# EAGLE schematic MEGA_shield_PORTS (EAGLE 7.5.0)
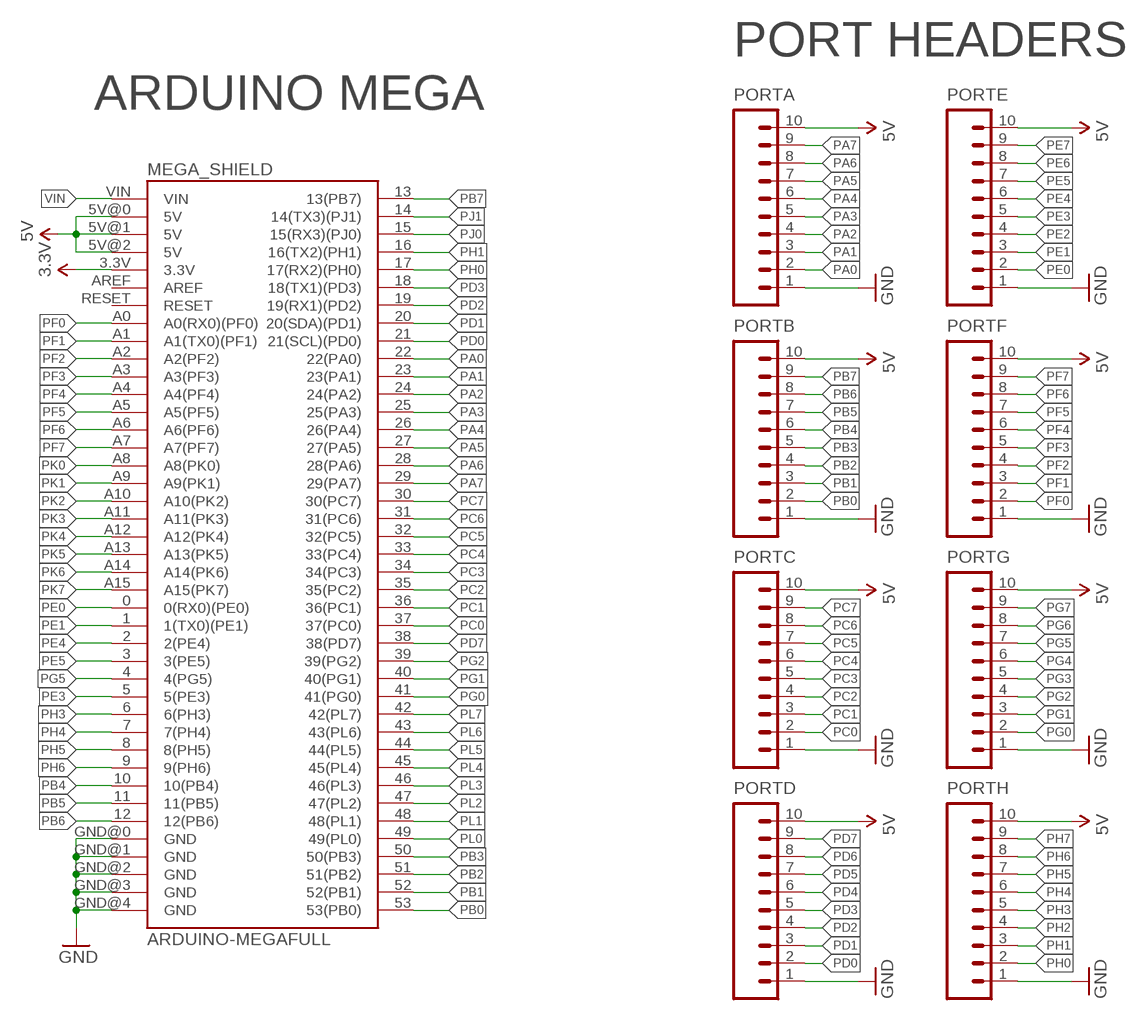
[diagram p0: schematic, sheet 1]

## Parts
MEGA_SHIELD  ARDUINO-MEGAFULL  [ARDUINO_MEGA]
PORTA  M10NO_SILK_PTH_FEMALE  [1X10_NO_SILK]
PORTB  M10NO_SILK_PTH_FEMALE  [1X10_NO_SILK]
PORTC  M10NO_SILK_PTH_FEMALE  [1X10_NO_SILK]
PORTD  M10NO_SILK_PTH_FEMALE  [1X10_NO_SILK]
PORTE  M10NO_SILK_PTH_FEMALE  [1X10_NO_SILK]
PORTF  M10NO_SILK_PTH_FEMALE  [1X10_NO_SILK]
PORTG  M10NO_SILK_PTH_FEMALE  [1X10_NO_SILK]
PORTH  M10NO_SILK_PTH_FEMALE  [1X10_NO_SILK]

## Nets
3.3V: MEGA_SHIELD.3.3V
5V: MEGA_SHIELD.5V@0(5V) MEGA_SHIELD.5V@1(5V) MEGA_SHIELD.5V@2(5V) PORTA.10 PORTB.10 PORTC.10 PORTD.10 PORTE.10 PORTF.10 PORTG.10 PORTH.10
GND: MEGA_SHIELD.GND@0(GND) MEGA_SHIELD.GND@1(GND) MEGA_SHIELD.GND@2(GND) MEGA_SHIELD.GND@3(GND) MEGA_SHIELD.GND@4(GND) PORTA.1 PORTB.1 PORTC.1 PORTD.1 PORTE.1 PORTF.1 PORTG.1 PORTH.1
PA0: MEGA_SHIELD.22(22(PA0)) PORTA.2
PA1: MEGA_SHIELD.23(23(PA1)) PORTA.3
PA2: MEGA_SHIELD.24(24(PA2)) PORTA.4
PA3: MEGA_SHIELD.25(25(PA3)) PORTA.5
PA4: MEGA_SHIELD.26(26(PA4)) PORTA.6
PA5: MEGA_SHIELD.27(27(PA5)) PORTA.7
PA6: MEGA_SHIELD.28(28(PA6)) PORTA.8
PA7: MEGA_SHIELD.29(29(PA7)) PORTA.9
PB0: MEGA_SHIELD.53(53(PB0)) PORTB.2
PB1: MEGA_SHIELD.52(52(PB1)) PORTB.3
PB2: MEGA_SHIELD.51(51(PB2)) PORTB.4
PB3: MEGA_SHIELD.50(50(PB3)) PORTB.5
PB4: MEGA_SHIELD.10(10(PB4)) PORTB.6
PB5: MEGA_SHIELD.11(11(PB5)) PORTB.7
PB6: MEGA_SHIELD.12(12(PB6)) PORTB.8
PB7: MEGA_SHIELD.13(13(PB7)) PORTB.9
PC0: MEGA_SHIELD.37(37(PC0)) PORTC.2
PC1: MEGA_SHIELD.36(36(PC1)) PORTC.3
PC2: MEGA_SHIELD.35(35(PC2)) PORTC.4
PC3: MEGA_SHIELD.34(34(PC3)) PORTC.5
PC4: MEGA_SHIELD.33(33(PC4)) PORTC.6
PC5: MEGA_SHIELD.32(32(PC5)) PORTC.7
PC6: MEGA_SHIELD.31(31(PC6)) PORTC.8
PC7: MEGA_SHIELD.30(30(PC7)) PORTC.9
PD0: MEGA_SHIELD.21(21(SCL)(PD0)) PORTD.2
PD1: MEGA_SHIELD.20(20(SDA)(PD1)) PORTD.3
PD2: MEGA_SHIELD.19(19(RX1)(PD2)) PORTD.4
PD3: MEGA_SHIELD.18(18(TX1)(PD3)) PORTD.5
PD4: PORTD.6
PD5: PORTD.7
PD6: PORTD.8
PD7: MEGA_SHIELD.38(38(PD7)) PORTD.9
PE0: MEGA_SHIELD.0(0(RX0)(PE0)) PORTE.2
PE1: MEGA_SHIELD.1(1(TX0)(PE1)) PORTE.3
PE2: PORTE.4
PE3: MEGA_SHIELD.5(5(PE3)) PORTE.5
PE4: MEGA_SHIELD.2(2(PE4)) PORTE.6
PE5: MEGA_SHIELD.3(3(PE5)) PORTE.7
PE6: PORTE.8
PE7: PORTE.9
PF0: MEGA_SHIELD.A0(A0(RX0)(PF0)) PORTF.2
PF1: MEGA_SHIELD.A1(A1(TX0)(PF1)) PORTF.3
PF2: MEGA_SHIELD.A2(A2(PF2)) PORTF.4
PF3: MEGA_SHIELD.A3(A3(PF3)) PORTF.5
PF4: MEGA_SHIELD.A4(A4(PF4)) PORTF.6
PF5: MEGA_SHIELD.A5(A5(PF5)) PORTF.7
PF6: MEGA_SHIELD.A6(A6(PF6)) PORTF.8
PF7: MEGA_SHIELD.A7(A7(PF7)) PORTF.9
PG0: MEGA_SHIELD.41(41(PG0)) PORTG.2
PG1: MEGA_SHIELD.40(40(PG1)) PORTG.3
PG2: MEGA_SHIELD.39(39(PG2)) PORTG.4
PG3: PORTG.5
PG4: PORTG.6
PG5: MEGA_SHIELD.4(4(PG5)) PORTG.7
PG6: PORTG.8
PG7: PORTG.9
PH0: MEGA_SHIELD.17(17(RX2)(PH0)) PORTH.2
PH1: MEGA_SHIELD.16(16(TX2)(PH1)) PORTH.3
PH2: PORTH.4
PH3: MEGA_SHIELD.6(6(PH3)) PORTH.5
PH4: MEGA_SHIELD.7(7(PH4)) PORTH.6
PH5: MEGA_SHIELD.8(8(PH5)) PORTH.7
PH6: MEGA_SHIELD.9(9(PH6)) PORTH.8
PH7: PORTH.9
PJ0: MEGA_SHIELD.15(15(RX3)(PJ0))
PJ1: MEGA_SHIELD.14(14(TX3)(PJ1))
PK0: MEGA_SHIELD.A8(A8(PK0))
PK1: MEGA_SHIELD.A9(A9(PK1))
PK2: MEGA_SHIELD.A10(A10(PK2))
PK3: MEGA_SHIELD.A11(A11(PK3))
PK4: MEGA_SHIELD.A12(A12(PK4))
PK5: MEGA_SHIELD.A13(A13(PK5))
PK6: MEGA_SHIELD.A14(A14(PK6))
PK7: MEGA_SHIELD.A15(A15(PK7))
PL0: MEGA_SHIELD.49(49(PL0))
PL1: MEGA_SHIELD.48(48(PL1))
PL2: MEGA_SHIELD.47(47(PL2))
PL3: MEGA_SHIELD.46(46(PL3))
PL4: MEGA_SHIELD.45(45(PL4))
PL5: MEGA_SHIELD.44(44(PL5))
PL6: MEGA_SHIELD.43(43(PL6))
PL7: MEGA_SHIELD.42(42(PL7))
VIN: MEGA_SHIELD.VIN
Unconnected: MEGA_SHIELD.AREF MEGA_SHIELD.RESET

## Notes on the sheet
- PORT HEADERS
- ARDUINO MEGA

## Library data of the parts
MEGA_SHIELD = Nathans-Arduinos:ARDUINO-MEGA: Arduino Mega board footprint
PORTA PORTB PORTC PORTD PORTE PORTF PORTG PORTH = SparkFun-Connectors:M10: Header 10 Standard 10-pin 0.1" header. Use with straight break away headers (SKU : PRT-00116), right angle break away headers (PRT-00553), swiss pins (PRT-00743), machine pins (PRT-00117), and female headers (PRT-00115).; PROD_ID: CONN-11563